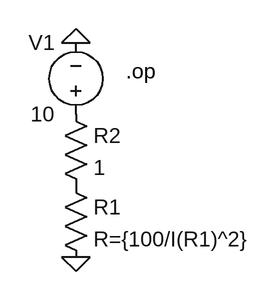
[diagram p0: schematic Draft2.asc]
Draft2.asc, the LTspice schematic file:
Version 4
SHEET 1 880 680
FLAG 112 48 0
FLAG 112 288 0
SYMBOL res 96 192 R0
SYMATTR InstName R1
SYMATTR Value R={100/I(R1)^2}
SYMBOL voltage 112 144 R180
WINDOW 0 24 96 Left 2
WINDOW 3 24 16 Left 2
WINDOW 123 0 0 Left 0
WINDOW 39 0 0 Left 0
SYMATTR InstName V1
SYMATTR Value 10
SYMBOL res 96 112 R0
SYMATTR InstName R2
SYMATTR Value 1
TEXT 168 80 Left 2 !.op

The netlist it stands for:
* Draft2.asc
R1 P001 0 R={100/I(R1)^2}
V1 P002 0 10
R2 P002 P001 1
.op
.backanno
.end

* Results of the author's LTspice run, read from the files saved beside the schematic
* Operating Point:
*   V(p001) = 5 V
*   V(p002) = 10 V
*   I(R1) = nan A
*   I(R2) = 5 A
*   I(V1) = -5 A